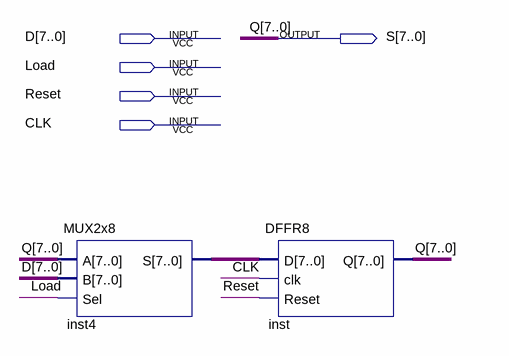
[diagram p0: schematic sheet]
// Quartus schematic REG8.bdf as structural Verilog: 2 symbols, 5 pins
module REG8 (
  input  [7:0] D,
  input  Load,
  input  Reset,
  input  CLK,
  output [7:0] S
);

  wire [7:0] inst4_s;

  MUX2x8 inst4 (.A(S), .B(D), .Sel(Load), .S(inst4_s));
  DFFR8 inst (.D(inst4_s), .clk(CLK), .Reset(Reset), .Q(S));

  // Other names for the same wires on the sheet: Q[7:0] = S
endmodule
